# Altium project kamizelka_sens.PrjPcb
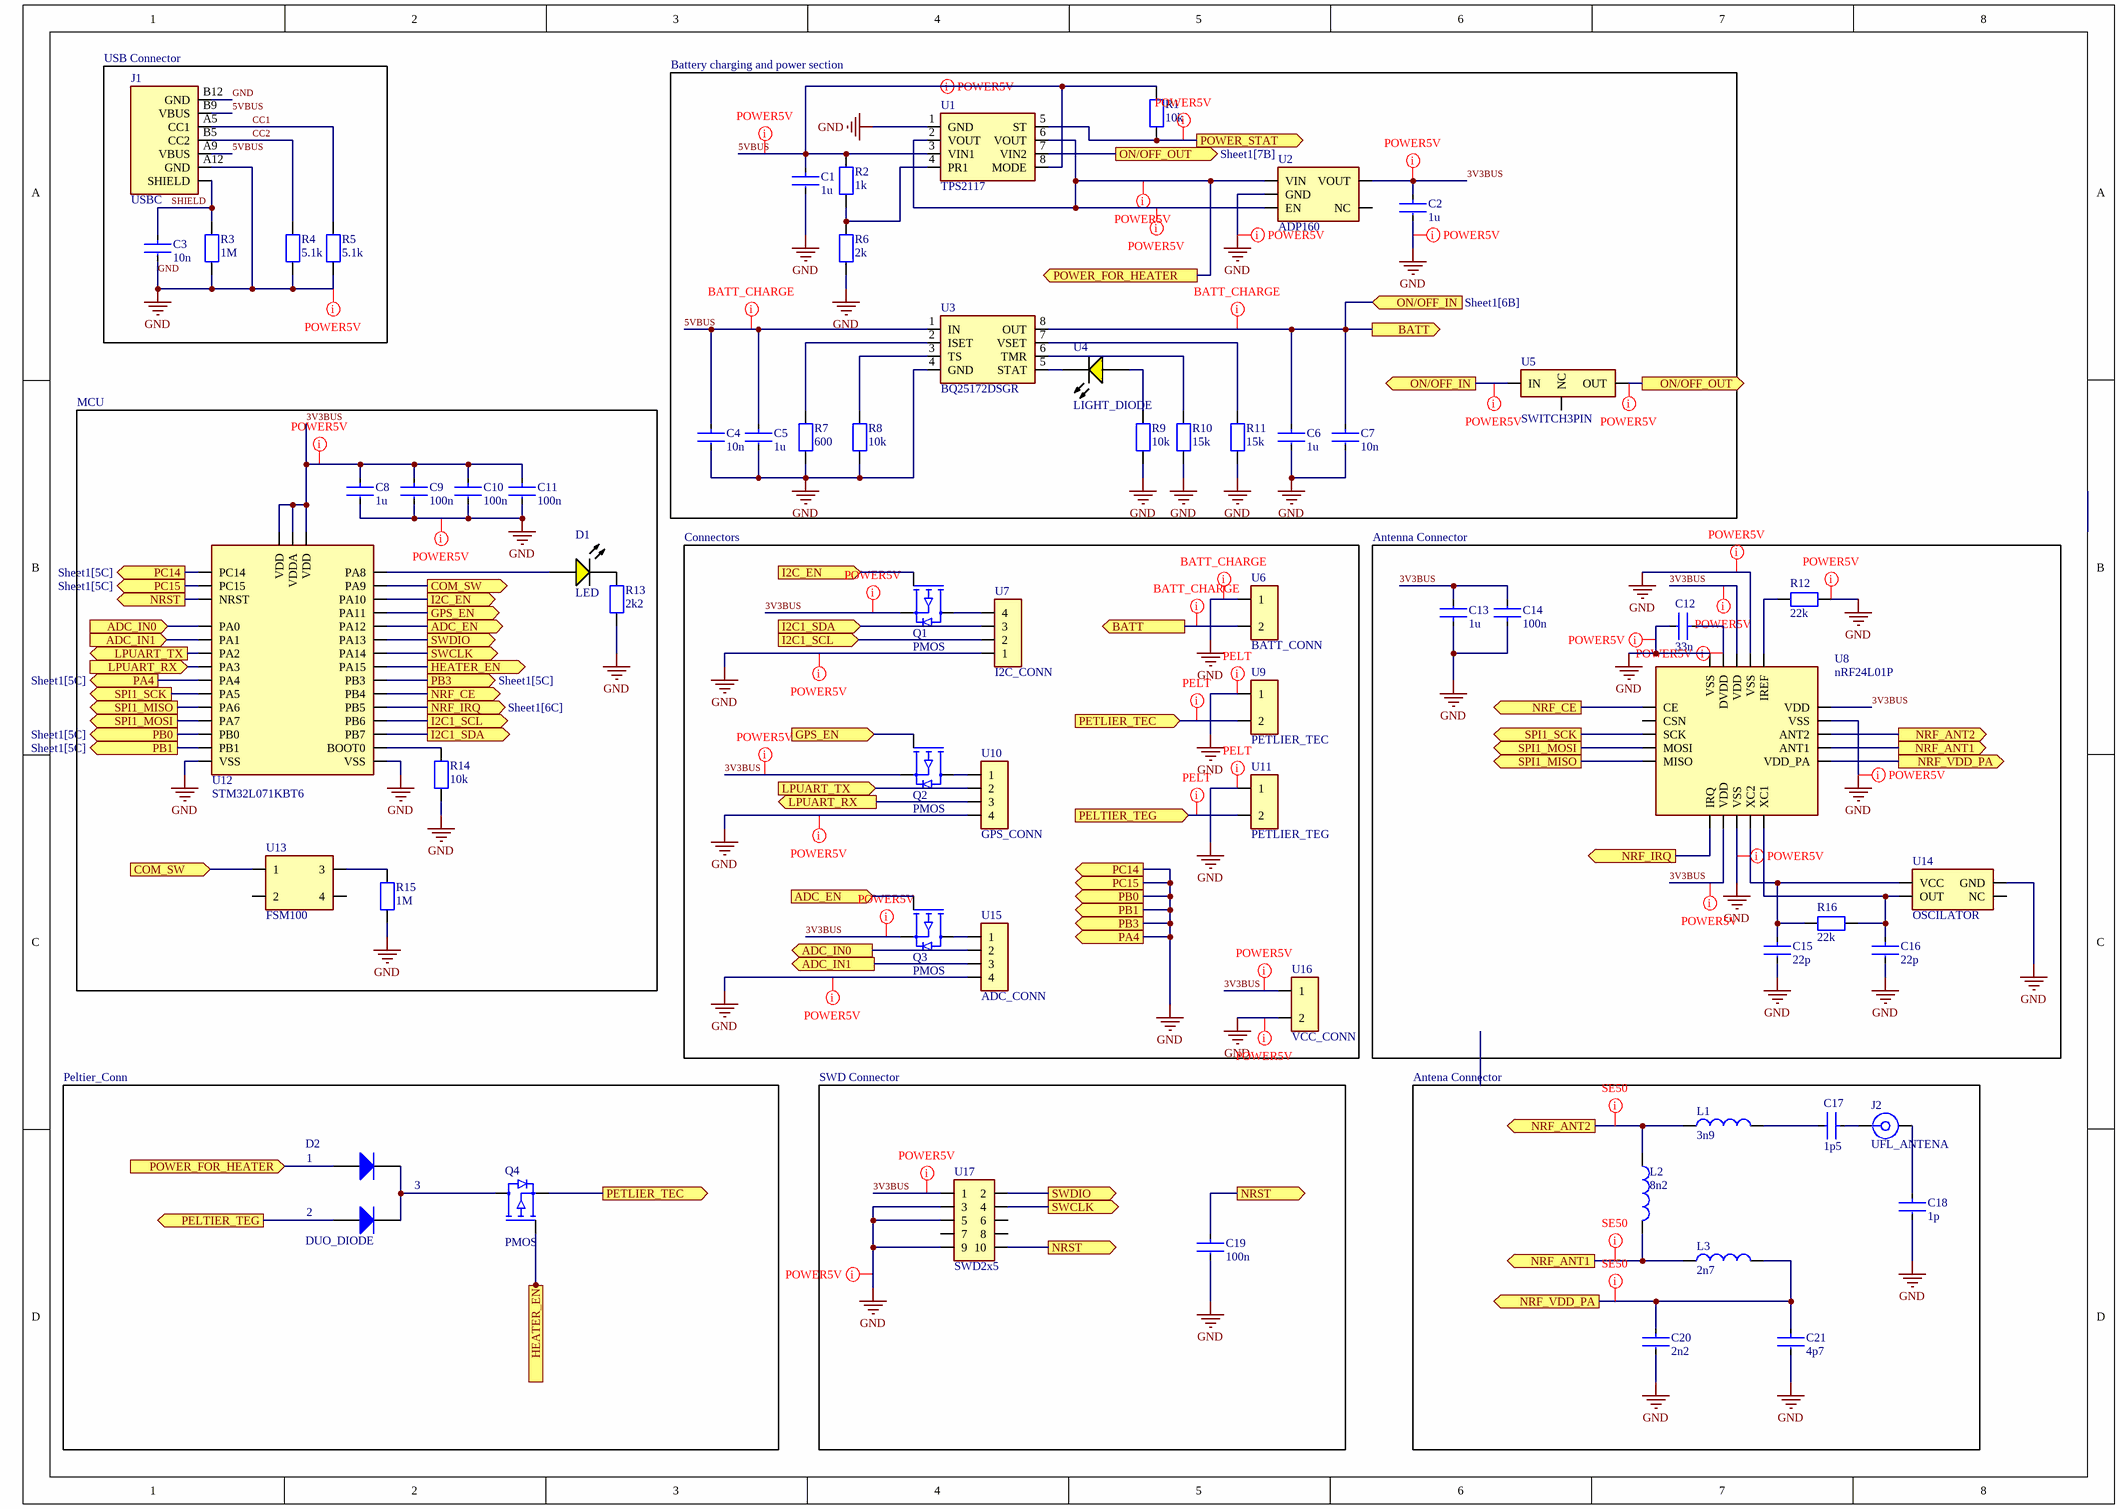
[diagram p0: Sheet1.SchDoc]
1 sheet, 69 parts. Net scope: flat (ports and power ports of the same name join across sheets).
Board file: PCB1.PcbDoc

## Sheet Sheet1.SchDoc
size A3; CheckedBy: Domin; Author: Domin; CompanyName: AGH; SheetNumber: 1; SheetTotal: 1

### Parts
(Parts that share a designator on the sheet are numbered #1, #2 ... from top to bottom, then left to right.)
?#1  (no value)  (net tie, no BOM)
?#2  (no value)
?#3  (no value)
?#4  (no value)  (no BOM)
C1  1u  [0603]
C2  1u  [0603]
C3  10n  [0603]
C4  10n  [0603]
C5  1u  [0603]
C6  1u  [0603]
C7  10n  [0603]
C8  1u  [0603]
C9  100n  [0603]
C10  100n  [0603]
C11  100n  [0603]
C12  33n  [0603]
C13  1u  [0603]
C14  100n  [0603]
C15  22p  [0603]
C16  22p  [0603]
C17  1p5  [0603]
C18  1p  [0603]
C19  100n  [0603]
C20  2n2  [0603]
C21  4p7  [0603]
D1  LED  [LIGHT_DIODE]
D2  DUO_DIODE  [DUO_DIODE]
J1  USBC  [USB_C]
J2  UFL_ANTENA  [UFL_ANTENA]
L1  3n9  [0603]
L2  8n2  [0603]
L3  2n7  [0603]
Q1  PMOS  [SOT95P245X112-3N]
Q2  PMOS  [SOT95P245X112-3N]
Q3  PMOS  [SOT95P245X112-3N]
Q4  PMOS  [SOT95P245X112-3N]
R1  10k  [0603]
R2  1k  [0603]
R3  1M  [0603]
R4  5.1k  [0603]
R5  5.1k  [0603]
R6  2k  [0603]
R7  600  [0603]
R8  10k  [0603]
R9  10k  [0603]
R10  15k  [0603]
R11  15k  [0603]
R12  22k  [0603]
R13  2k2  [0603]
R14  10k  [0603]
R15  1M  [0603]
R16  22k  [0603]
U1  TPS2117  [TPS2117]
U2  ADP160  [ADP160]
U3  BQ25172DSGR  [BQ25172]
U4  LIGHT_DIODE  [LIGHT_DIODE]
U5  SWITCH3PIN  [SWITCH]
U6  BATT_CONN  [2_54x2]
U7  I2C_CONN  [2_54x4]
U8  nRF24L01P  [nRF24L01P]
U9  PETLIER_TEC  [2_54x2]
U10  GPS_CONN  [2_54x4]
U11  PETLIER_TEG  [2_54x2]
U12  STM32L071KBT6  [STM32L0]
U13  FSM100  [FSM100]
U14  OSCILATOR  [OSCILATOR]
U15  ADC_CONN  [2_54x4]
U16  VCC_CONN  [2_54x2]
U17  SWD2x5  [SWD2x5]

### Blocks framed on the sheet
USB Connector: C3 J1 R3-R5
Battery charging and power section: C1 C2 C4-C7 R1 R2 R6-R11 U1-U5
MCU: C8-C11 D1 R13-R15 U12 U13
Connectors: ?#1-?#4 Q1-Q3 U6 U7 U9-U11 U15 U16
Antenna Connector: C12-C16 R12 R16 U8 U14
Peltier_Conn: D2 Q4
SWD Connector: C19 U17
Antena Connector: C17 C18 C20 C21 J2 L1-L3

### Ports
ADC_EN (in, see Sheet1[2B]), ADC_EN (out, see Sheet1[3C]), ADC_IN0 (in, see Sheet1[3C]), ADC_IN0 (out, see Sheet1[1B]), ADC_IN1 (in, see Sheet1[3C]), ADC_IN1 (out, see Sheet1[1B]), BATT (out, see Sheet1[5B]), BATT (out, see Sheet1[6A]), COM_SW (in, see Sheet1[2B]), COM_SW (out, see Sheet1[1C]), GPS_EN (in, see Sheet1[2B]), GPS_EN (out, see Sheet1[3B]), HEATER_EN (out, see Sheet1[2B]), HEATER_EN (out, see Sheet1[2D]), I2C1_SCL (in, see Sheet1[2B]), I2C1_SCL (out, see Sheet1[3B]), I2C1_SDA (in, see Sheet1[2B]), I2C1_SDA (out, see Sheet1[3B]), I2C_EN (in, see Sheet1[2B]), I2C_EN (out, see Sheet1[3B]), LPUART_RX (in, see Sheet1[3C]), LPUART_RX (out, see Sheet1[1B]), LPUART_TX (in, see Sheet1[1B]), LPUART_TX (out, see Sheet1[3C]), NRF_ANT1 (out, see Sheet1[6D]), NRF_ANT1 (out, see Sheet1[8B]), NRF_ANT2 (out, see Sheet1[6C]), NRF_ANT2 (out, see Sheet1[8B]), NRF_CE (out, see Sheet1[2B]), NRF_CE (out, see Sheet1[6B]), NRF_IRQ (out, see Sheet1[2B]), NRF_IRQ (out, see Sheet1[6C]), NRF_VDD_PA (out, see Sheet1[6D]), NRF_VDD_PA (out, see Sheet1[8C]), NRST (out, see Sheet1[1B], Sheet1[4D]), NRST (out, see Sheet1[1B], Sheet1[5D]), NRST (out, see Sheet1[4D], Sheet1[5D]), ON/OFF_IN (in, see Sheet1[6B]), ON/OFF_IN (out, see Sheet1[6A]), ON/OFF_OUT (out, see Sheet1[5A]), ON/OFF_OUT (out, see Sheet1[7B]), PA4 (out, see Sheet1[1B]), PA4 (out, see Sheet1[5C]), PB0 (out, see Sheet1[1B]), PB0 (out, see Sheet1[5C]), PB1 (out, see Sheet1[1B]), PB1 (out, see Sheet1[5C]), PB3 (out, see Sheet1[2B]), PB3 (out, see Sheet1[5C]), PC14 (out, see Sheet1[1B]), PC14 (out, see Sheet1[5C]), PC15 (out, see Sheet1[1B]), PC15 (out, see Sheet1[5C]), PELTIER_TEG (in, see Sheet1[1D]), PELTIER_TEG (out, see Sheet1[5C]), PETLIER_TEC (in, see Sheet1[3D]), PETLIER_TEC (out, see Sheet1[5B]), POWER_FOR_HEATER (in, see Sheet1[4A]), POWER_FOR_HEATER (out, see Sheet1[1D]), POWER_STAT (out), SPI1_MISO (out, see Sheet1[1B]), SPI1_MISO (out, see Sheet1[6C]), SPI1_MOSI (out, see Sheet1[1B]), SPI1_MOSI (out, see Sheet1[6B]), SPI1_SCK (out, see Sheet1[1B]), SPI1_SCK (out, see Sheet1[6B]), SWCLK (out, see Sheet1[2B]), SWCLK (out, see Sheet1[4D]), SWDIO (out, see Sheet1[2B]), SWDIO (out, see Sheet1[4D])

### Nets
GND: C1.2 C2.2 C3.2 C4.2 C5.2 C6.2 C7.2 C8.2 C9.2 C10.2 C11.2 C12.2 C13.1 C14.1 C15.2 C16.2 C18.2 C19.2 C20.2 C21.2 J1.A12(GND) J1.B12(GND) R3.1 R4.1 R5.1 R6.1 R7.1 R8.1 R9.1 R10.1 R11.1 R12.1 R13.1 R14.2 R15.2 U1.1(GND) U2.2(GND) U3.4(GND) U6.1 U7.1 U8.8(VSS) U8.14(VSS) U8.17(VSS) U8.20(VSS) U9.1 U10.4 U11.1 U12.2(PC14) U12.3(PC15) U12.10(PA4) U12.14(PB0) U12.15(PB1) U12.16(VSS) U12.26(PB3) U12.32(VSS) U14.2(GND) U15.4 U16.2 U17.3 U17.5 U17.9 ; port PC14, port PC15, port PA4, port PB0, port PB1, port PB3
3V3BUS: C2.1 C8.1 C9.1 C10.1 C11.1 C13.2 C14.2 Q1.3(S) Q2.3(S) Q3.3(S) U2.4(VOUT) U8.7(VDD) U8.15(VDD) U8.18(VDD) U12.1(VDD) U12.5(VDDA) U12.17(VDD) U16.1 U17.1
5VBUS: C1.1 C4.1 C5.1 J1.A9(VBUS) J1.B9(VBUS) R1.1 R2.2 U1.3(VIN1) U1.8(MODE) U3.1(IN)
CC1: J1.A5(CC1) R5.2
CC2: J1.B5(CC2) R4.2
SHIELD: C3.1 J1.SHIELD R3.2
NetC6_1: C6.1 C7.1 U3.8(OUT) U5.1(IN) U6.2 ; port BATT, port ON/OFF_IN
NetC12_1: C12.1 U8.19(DVDD)
NetC15_1: C15.1 R16.1 U8.9(XC2) U14.4(VCC)
NetC16_1: C16.1 R16.2 U8.10(XC1) U14.3(OUT)
NetC17_1: C17.1 J2.1
NetC17_2: C17.2 L1.2
NetC18_1: C18.1 J2.2
NetC19_1: C19.1 U12.4(NRST) U17.10 ; port NRST
NetC20_1: C20.1 C21.1 L3.2 U8.11(VDD_PA) ; port NRF_VDD_PA
NetD1_1: D1.1(A) U12.18(PA8)
NetD1_2: D1.2(K) R13.2
NetD2_1: D2.1(A) U1.2(VOUT) U1.6(VOUT) U2.1(VIN) U2.3(EN) ; port POWER_FOR_HEATER
NetD2_2: D2.2(A) U11.2 ; port PELTIER_TEG
NetD2_3: D2.3(K) Q4.2(D)
NetL1_1: L1.1 L2.1 U8.13(ANT2) ; port NRF_ANT2
NetL2_2: L2.2 L3.1 U8.12(ANT1) ; port NRF_ANT1
NetQ1_1: Q1.1(G) U12.20(PA10) ; port I2C_EN
NetQ1_2: Q1.2(D) U7.4
NetQ2_1: Q2.1(G) U12.21(PA11) ; port GPS_EN
NetQ2_2: Q2.2(D) U10.1
NetQ3_1: Q3.1(G) U12.22(PA12) ; port ADC_EN
NetQ3_2: Q3.2(D) U15.1
NetQ4_1: Q4.1(G) U12.25(PA15) ; port HEATER_EN
NetQ4_3: Q4.3(S) U9.2 ; port PETLIER_TEC
NetR1_2: R1.2 U1.5(ST) ; port POWER_STAT
NetR2_1: R2.1 R6.2 U1.4(PR1)
NetR7_2: R7.2 U3.2(ISET)
NetR8_2: R8.2 U3.3(TS)
NetR9_2: R9.2 U4.1(A)
NetR10_2: R10.2 U3.6(TMR)
NetR11_2: R11.2 U3.7(VSET)
NetR12_2: R12.2 U8.16(IREF)
NetR14_1: R14.1 U12.31(BOOT0)
NetR15_1: R15.1 U13.3
NetU1_7: U1.7(VIN2) U5.2(OUT) ; port ON/OFF_OUT
NetU3_5: U3.5(STAT) U4.2(K)
NetU7_2: U7.2 U12.29(PB6) ; port I2C1_SCL
NetU7_3: U7.3 U12.30(PB7) ; port I2C1_SDA
NetU8_1: U8.1(CE) U12.27(PB4) ; port NRF_CE
NetU8_3: U8.3(SCK) U12.11(PA5) ; port SPI1_SCK
NetU8_4: U8.4(MOSI) U12.13(PA7) ; port SPI1_MOSI
NetU8_5: U8.5(MISO) U12.12(PA6) ; port SPI1_MISO
NetU8_6: U8.6(IRQ) U12.28(PB5) ; port NRF_IRQ
NetU10_2: U10.2 U12.8(PA2) ; port LPUART_TX
NetU10_3: U10.3 U12.9(PA3) ; port LPUART_RX
NetU12_6: U12.6(PA0) U15.2 ; port ADC_IN0
NetU12_7: U12.7(PA1) U15.3 ; port ADC_IN1
NetU12_19: U12.19(PA9) U13.1 ; port COM_SW
NetU12_23: U12.23(PA13) U17.2 ; port SWDIO
NetU12_24: U12.24(PA14) U17.4 ; port SWCLK

Not connected (* = marked no-connect by the designer): U2 5(NC); U5 3(NC); U8 2(CSN); U13 2 4; U14 1(NC); U17 6 7 8

### Layout directives
mark named POWER5V: 3V3BUS, 5VBUS, GND, NetC6_1, NetC12_1, NetD2_1, NetR1_2, NetU1_7
mark named BATT_CHARGE: 5VBUS, GND, NetC6_1
mark named PELT: GND, NetD2_2, NetQ4_3
mark named SE50: NetC20_1, NetL1_1, NetL2_2

### Notes on the sheet
- Nazwa Firmy
- Autor

### Library data of the parts
?#1 = ZWORA
?#2 R1-R16 = REZYSTOR
?#3 = 7805
?#4 = TESTPOINT
C1-C21 = CAP10nF: CAP CER 10000PF 10V X7R 0402; Manufacturer: Kemet; Manufacturer Part Number: C0402C103M8RACTU; Tolerance: 0.2; Material: Ceramic; Temperature Coefficient: 15%; Value: 10,000 pF; Voltage Rating: 10 V; ComponentLink2URL: https://content.kemet.com/datasheets/KEM_C1002_X7R_SMD.pdf; Octopart: https://octopart.com/c0402c103m8ractu-kemet-12595671; RoHS: TRUE; Automotive: No; Category: Cap; Temperature Range Low: -55°C; Package: C0402-BB; Lead Free: Yes; Ipc Land Pattern Name: CAPC10050X50; Height: 0.55mm; ComponentLink2Description: Datasheet; Temperature Characteristic: X7R; Mouser Description: Multilayer Ceramic Capacitors MLCC - SMD/SMT 10volts 10000pF X7R 20%; Temperature Range High: +125°C; Digikey Description: CAP CER 10000PF 10V X7R 0402; Device Class L1: Passive Components; Capacitance: 10,000 pF; Temperature: -55°C to +125°C; Device Class L3: Ceramic Capacitors; Device Class L2: Capacitors
D1 = LIGHT_DIODE
L1-L3 = INDUCTOR
U6 U9 U11 U16 = 2_54x2
U7 U10 U15 = 2_54x4